# EasyEDA schematic Polaritätswechsel-Schaltung.json
TITLE: Polaritätswechsel - Buffer Zone; REV: 1.0; Date: 2025-01-27; Sheet: 1/1; Drawn By: helmut-f; Company: ...
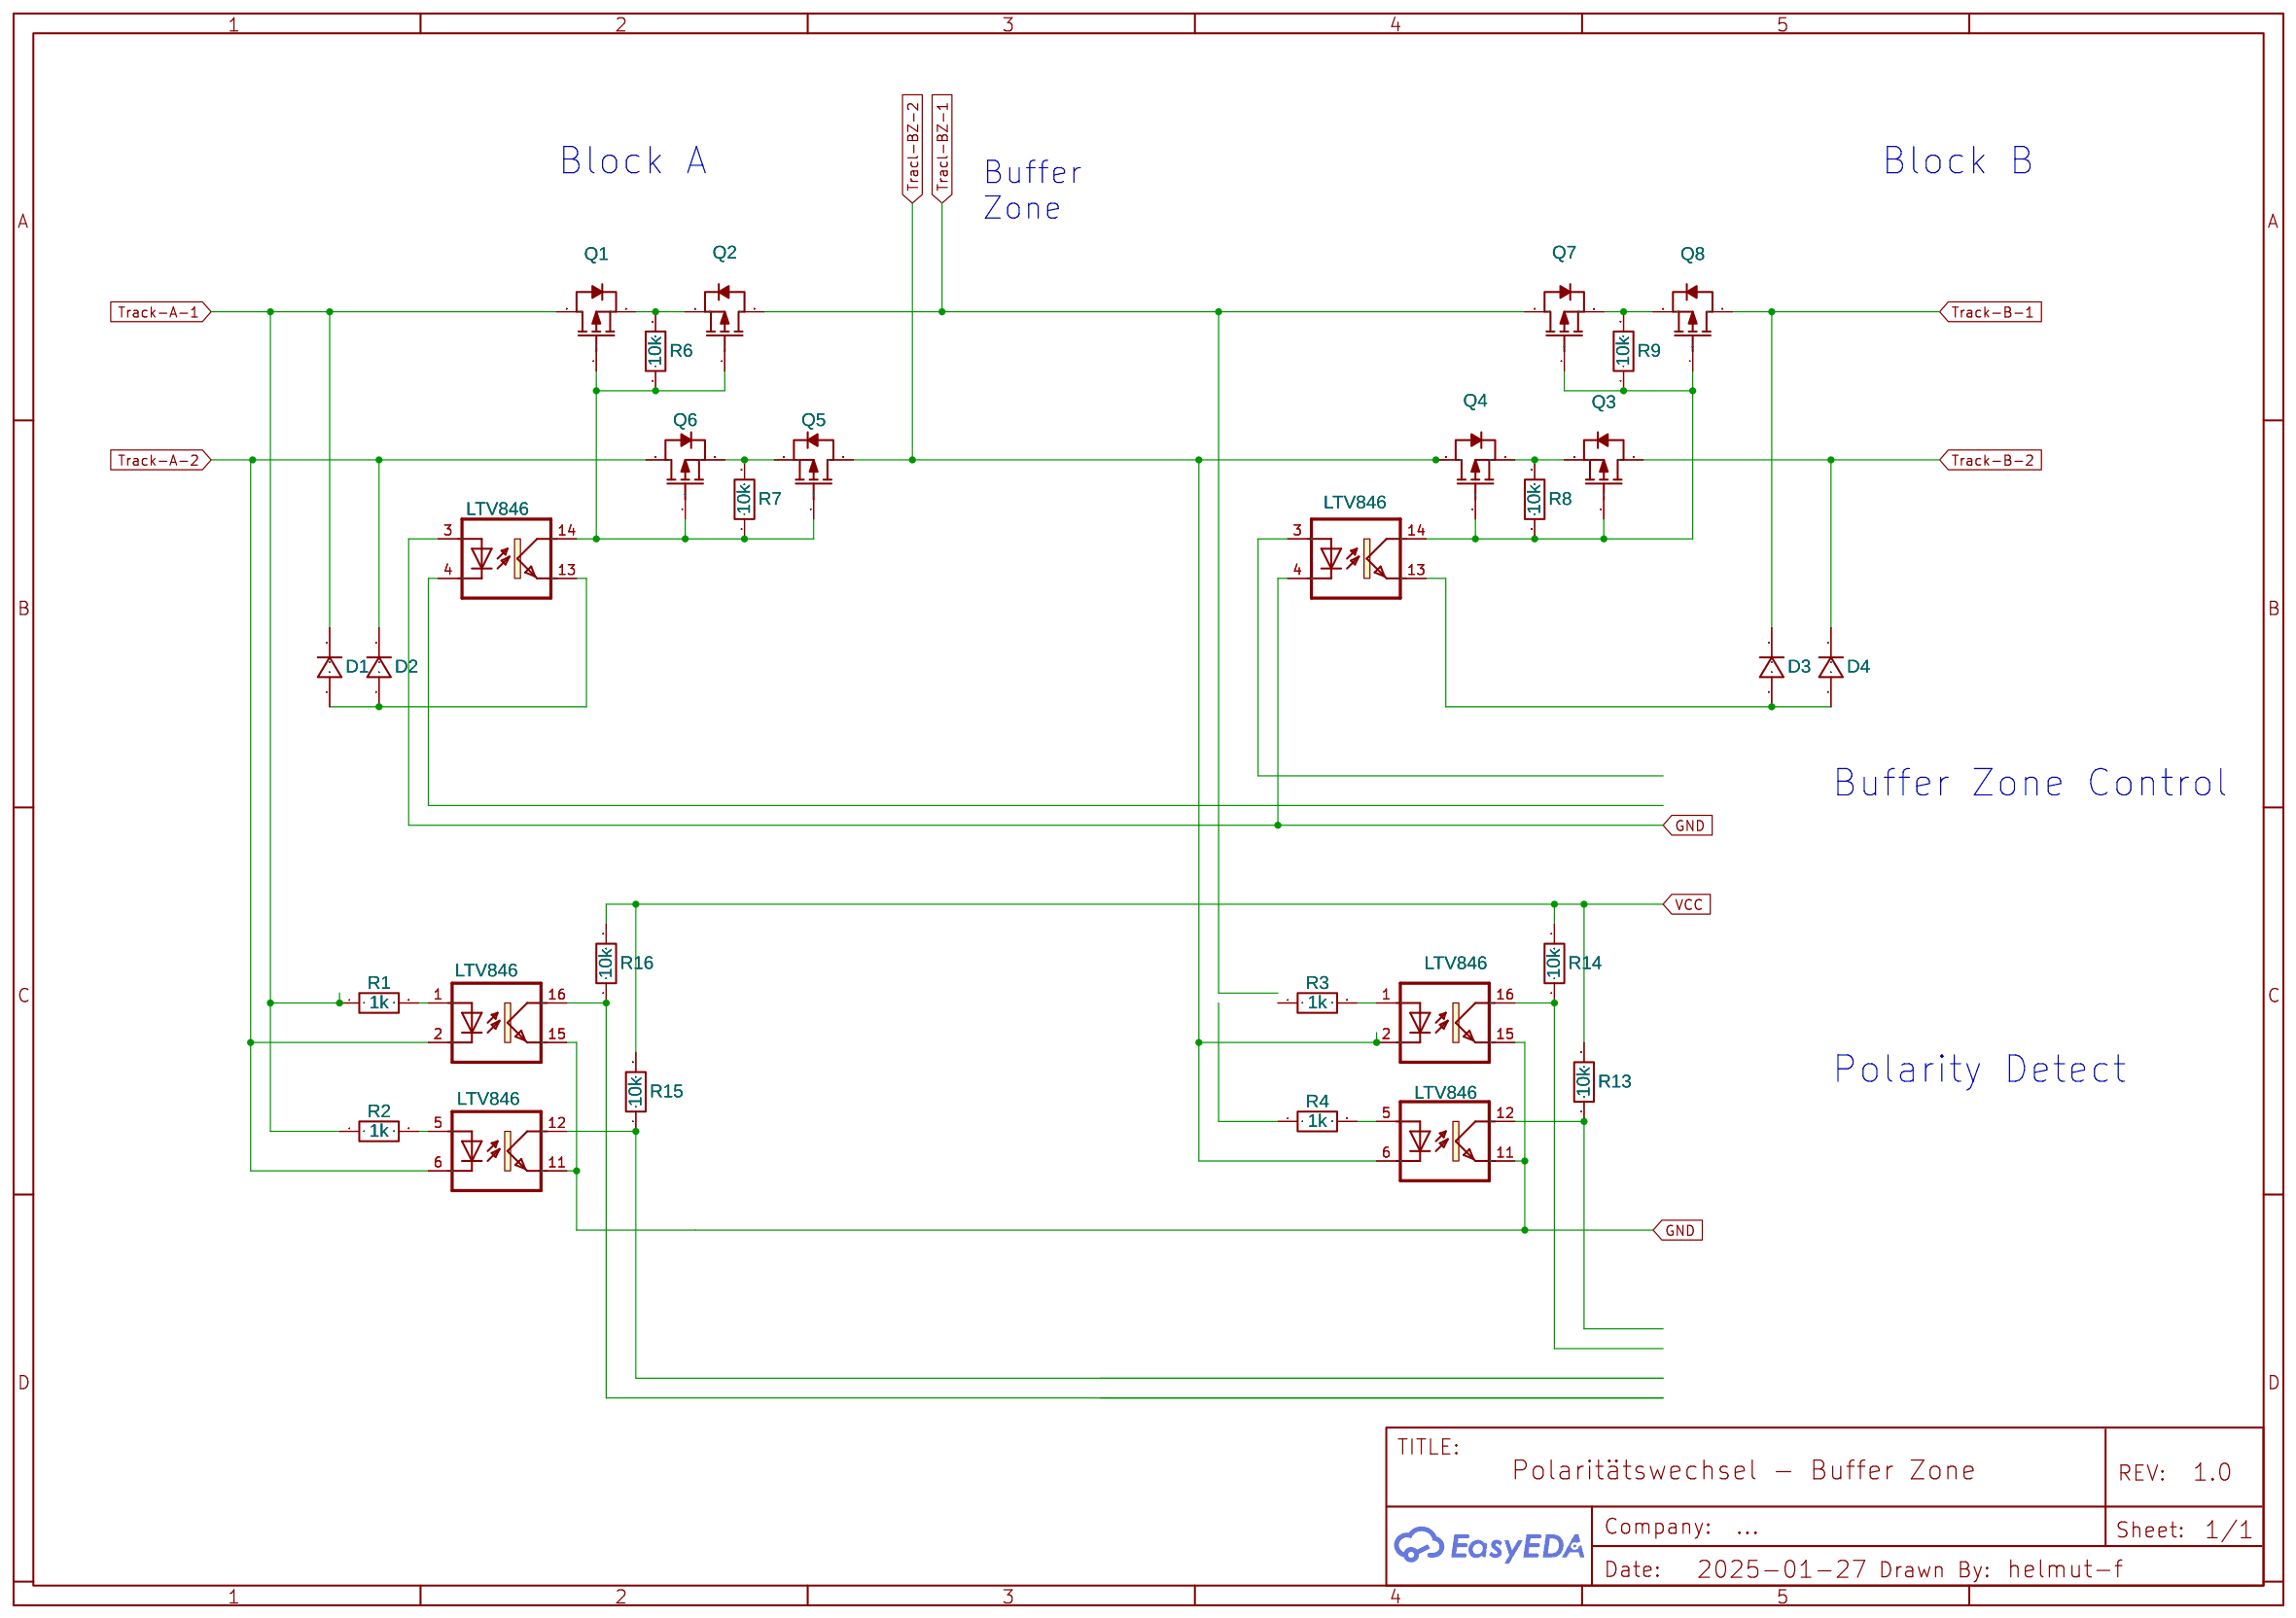
[diagram p0: schematic sheet]

## Parts
D1  1N4007W  [SOD-123_L2.8-W1.8-LS3.7-RD]
D2  1N4007W  [SOD-123_L2.8-W1.8-LS3.7-RD]
D3  1N4007W  [SOD-123_L2.8-W1.8-LS3.7-RD]
D4  1N4007W  [SOD-123_L2.8-W1.8-LS3.7-RD]
G$1G$1  LTV846  [MINI-FLAT-16]  (section 2)
G$1G$3  LTV846  [MINI-FLAT-16]  (section 2)
G$2G$1  LTV846  [MINI-FLAT-16]  (sections 1,2)
G$2G$2  LTV846  [MINI-FLAT-16]  (section 2)
G$2G$3  LTV846  [MINI-FLAT-16]  (section 1)
Q1  IRF9540_C7496537  [TO-220-3_L9.9-W4.5-P2.54-L-1]
Q2  IRF9540_C7496537  [TO-220-3_L9.9-W4.5-P2.54-L-1]
Q3  IRF9540_C7496537  [TO-220-3_L9.9-W4.5-P2.54-L-1]
Q4  IRF9540_C7496537  [TO-220-3_L9.9-W4.5-P2.54-L-1]
Q5  IRF9540_C7496537  [TO-220-3_L9.9-W4.5-P2.54-L-1]
Q6  IRF9540_C7496537  [TO-220-3_L9.9-W4.5-P2.54-L-1]
Q7  IRF9540_C7496537  [TO-220-3_L9.9-W4.5-P2.54-L-1]
Q8  IRF9540_C7496537  [TO-220-3_L9.9-W4.5-P2.54-L-1]
R1  1k  [R_AXIAL-0.3]
R2  1k  [R_AXIAL-0.3]
R3  1k  [R_AXIAL-0.3]
R4  1k  [R_AXIAL-0.3]
R6  10k  [R_AXIAL-0.3]
R7  10k  [R_AXIAL-0.3]
R8  10k  [R_AXIAL-0.3]
R9  10k  [R_AXIAL-0.3]
R13  10k  [R_AXIAL-0.3]
R14  10k  [R_AXIAL-0.3]
R15  10k  [R_AXIAL-0.3]
R16  10k  [R_AXIAL-0.3]

## Library data of the parts
D1-D4 = 1N4007W: Supplier: LCSC; Supplier Part: C328592; Manufacturer: BLUE ROCKET; Contributor: LCEDA_Lib
G$1G$1 G$1G$3 G$2G$1-G$2G$3 = LTV846: Contributor: BARD; subpart_no: 1
Q1-Q8 = IRF9540_C7496537: Supplier: LCSC; Supplier Part: C7496537; Manufacturer: Slkor(萨科微); Manufacturer Part: IRF9540; Contributor: lcsc
R1-R4 R6-R9 R13-R16 = R_AXIAL-0.3_EU: Contributor: LCEDA_Lib

## Nets
GND: G$1G$1.4(C) G$1G$3.3(A) G$2G$1.11(EMIT) G$2G$1.15(EMIT) G$2G$2.11(EMIT) G$2G$3.15(EMIT)
VCC: R13.2 R14.2 R15.2 R16.2
Track-A-1: D1.1 Q1.2(D) R1.1 R2.1
Track-A-2: D2.1 G$2G$1.2(C) G$2G$2.6(C) Q6.2(D)
Track-B-1: D3.1 Q8.2(D)
Track-B-2: D4.1 Q3.2(D)
Tracl-BZ-1: Q2.2(D) Q7.2(D)
Tracl-BZ-2: G$2G$1.6(C) G$2G$3.2(C) Q4.2(D) Q5.2(D)
Net-(D1-2): D1.2 D2.2 G$1G$3.13(EMIT)
Net-(D3-2): D3.2 D4.2 G$1G$1.13(EMIT)
Net-(G$1G$1.2-14): G$1G$1.14(COL) Q3.1(G) Q4.1(G) Q7.1(G) Q8.1(G) R8.1 R9.1
Net-(G$1G$3.2-14): G$1G$3.14(COL) Q1.1(G) Q2.1(G) Q5.1(G) Q6.1(G) R6.1 R7.1
Net-(G$2G$1.1-1): G$2G$1.1(A) R1.2
Net-(G$2G$1.1-16): G$2G$1.16(COL) R16.1
Net-(G$2G$1.2-5): G$2G$1.5(A) R4.2
Net-(G$2G$1.2-12): G$2G$1.12(COL) R13.1
Net-(G$2G$2.2-5): G$2G$2.5(A) R2.2
Net-(G$2G$2.2-12): G$2G$2.12(COL) R15.1
Net-(G$2G$3.1-1): G$2G$3.1(A) R3.2
Net-(G$2G$3.1-16): G$2G$3.16(COL) R14.1
Net-(Q1-3): Q1.3(S) Q2.3(S) R6.2
Net-(Q3-3): Q3.3(S) Q4.3(S) R8.2
Net-(Q5-3): Q5.3(S) Q6.3(S) R7.2
Net-(Q7-3): Q7.3(S) Q8.3(S) R9.2

Not connected (* = marked no-connect by the designer): G$1G$1 3(A); G$1G$3 4(C); R3 1; R4 1

## Notes on the sheet
- Block A
- Buffer
  Zone
- Block B
- Buffer Zone Control
- Polarity Detect
